# Altium schematic sheet Microcontroller_sch_v22_0.SchDoc
size 326 x 130 mm; Origin: Eagle
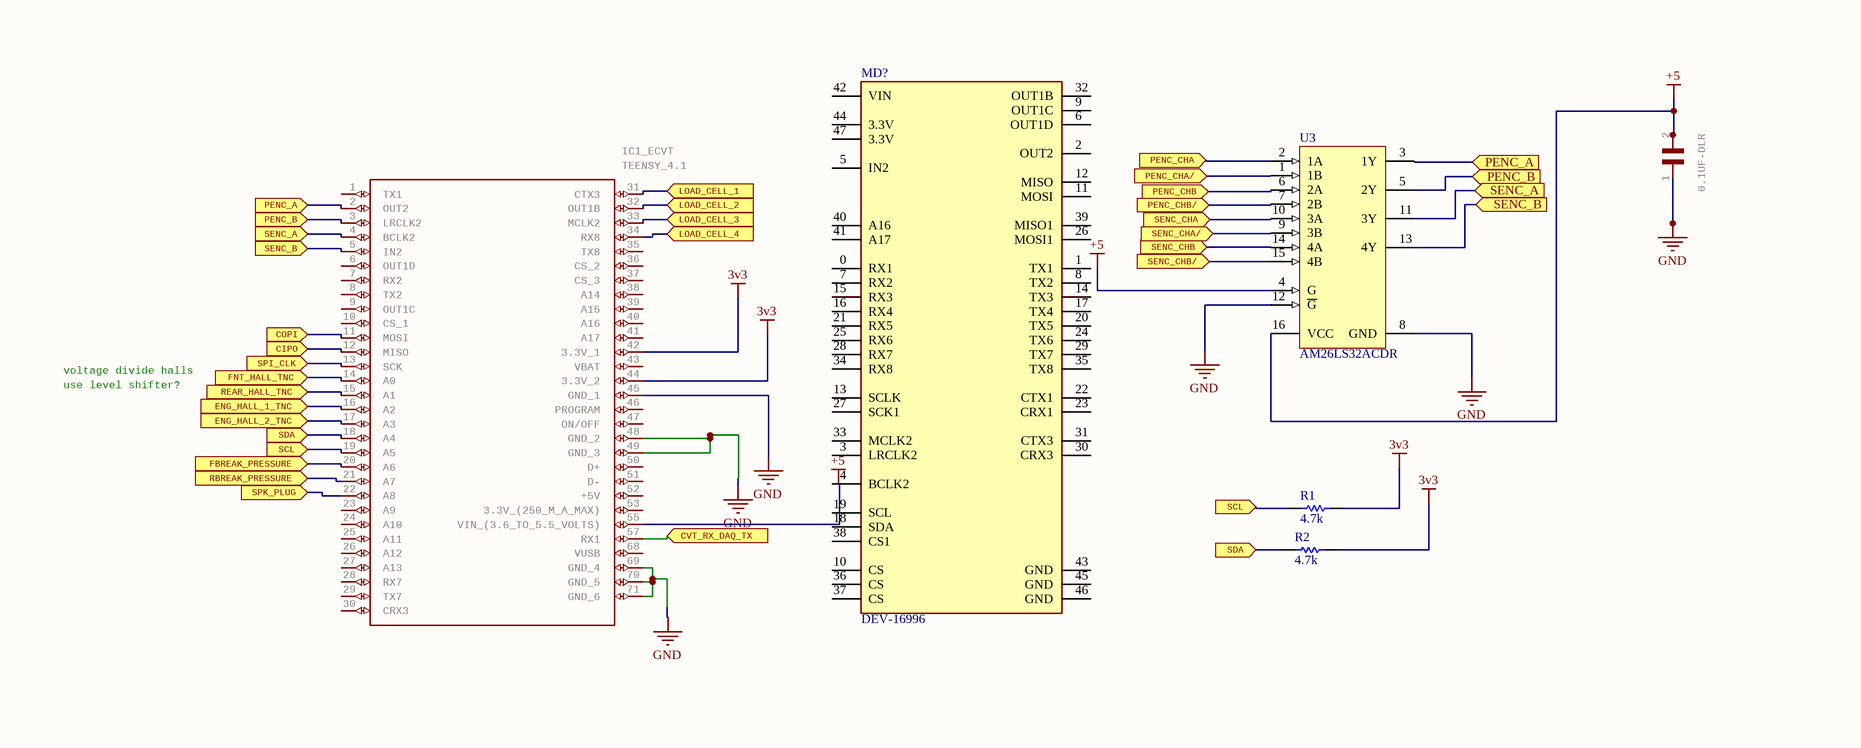
[diagram p0: Microcontroller_sch_v22_0.SchDoc]

## Parts
0.1UF-DLR  08055C104KAT4A  [RESC2012X60N]  (value not drawn)
IC1_ECVT  TEENSY_4.1  [TEENSY41]
MD?  DEV-16996  [FP-DEV-16996-MFG]
R1  4.7k  [RESC2013X50X30LL20T20]
R2  4.7k  [RESC2013X50X30LL20T20]
U3  AM26LS32ACDR  [D0016A_M]

## Ports
CIPO (in, see Microcontroller_sch_v22_1[1B], Microcontroller_sch_v22_1[5C], Microcontroller_sch_v22_4[3C], Microcontroller_sch_v22_4[4C]), COPI (in, see Microcontroller_sch_v22_1[1B], Microcontroller_sch_v22_1[5C], Microcontroller_sch_v22_4[2C], Microcontroller_sch_v22_4[4C]), CVT_RX_DAQ_TX (in, see Microcontroller_sch_v22_1[0A], Microcontroller_sch_v22_2[2C]), ENG_HALL_1_TNC (in, see Microcontroller_sch_v22_1[0C], Microcontroller_sch_v22_3[5B]), ENG_HALL_2_TNC (in, see Microcontroller_sch_v22_1[0C], Microcontroller_sch_v22_3[6B]), FBREAK_PRESSURE (in, see Microcontroller_sch_v22_1[0C], Microcontroller_sch_v22_2[2D]), FNT_HALL_TNC (in, see Microcontroller_sch_v22_1[0B], Microcontroller_sch_v22_3[3B]), LOAD_CELL_1 (in, see Microcontroller_sch_v22_2[4E]), LOAD_CELL_2 (in, see Microcontroller_sch_v22_2[4F]), LOAD_CELL_3 (in, see Microcontroller_sch_v22_2[4F]), LOAD_CELL_4 (in, see Microcontroller_sch_v22_2[4F]), PENC_A (in, see Microcontroller_sch_v22_0[1B]), PENC_A (in, see Microcontroller_sch_v22_0[5A]), PENC_B (in, see Microcontroller_sch_v22_0[1B]), PENC_B (in, see Microcontroller_sch_v22_0[5A]), PENC_CHA (in, see Microcontroller_sch_v22_2[2E]), PENC_CHA/ (in, see Microcontroller_sch_v22_2[2E]), PENC_CHB (in, see Microcontroller_sch_v22_2[2E]), PENC_CHB/ (in, see Microcontroller_sch_v22_2[2F]), RBREAK_PRESSURE (in, see Microcontroller_sch_v22_1[0C], Microcontroller_sch_v22_2[2D]), REAR_HALL_TNC (in, see Microcontroller_sch_v22_1[0B], Microcontroller_sch_v22_3[4B]), SCL (in, see Microcontroller_sch_v22_0[1C], Microcontroller_sch_v22_1[1C], Microcontroller_sch_v22_2[2D]), SCL (in, see Microcontroller_sch_v22_0[4C], Microcontroller_sch_v22_1[1C], Microcontroller_sch_v22_2[2D]), SDA (in, see Microcontroller_sch_v22_0[1C], Microcontroller_sch_v22_1[1C], Microcontroller_sch_v22_2[2C]), SDA (in, see Microcontroller_sch_v22_0[4C], Microcontroller_sch_v22_1[1C], Microcontroller_sch_v22_2[2C]), SENC_A (in, see Microcontroller_sch_v22_0[1B]), SENC_A (in, see Microcontroller_sch_v22_0[5B]), SENC_B (in, see Microcontroller_sch_v22_0[1B]), SENC_B (in, see Microcontroller_sch_v22_0[5B]), SENC_CHA (in, see Microcontroller_sch_v22_2[4B]), SENC_CHA/ (in, see Microcontroller_sch_v22_2[4B]), SENC_CHB (in, see Microcontroller_sch_v22_2[2F]), SENC_CHB/ (in, see Microcontroller_sch_v22_2[2F]), SPI_CLK (in, see Microcontroller_sch_v22_1[0B], Microcontroller_sch_v22_1[4C], Microcontroller_sch_v22_2[4B], Microcontroller_sch_v22_4[2C], Microcontroller_sch_v22_4[4C]), SPK_PLUG (in, see Microcontroller_sch_v22_1[0C], Microcontroller_sch_v22_2[2D])

## Nets
3v3: IC1_ECVT.42(3.3V_1) IC1_ECVT.44(3.3V_2) R1.2 R2.2
+5: 0.1UF-DLR.2 IC1_ECVT.55(VIN_(3.6_TO_5.5_VOLTS)) U3.4(G) U3.16(VCC)
GND: 0.1UF-DLR.1 IC1_ECVT.45(GND_1) IC1_ECVT.48(GND_2) IC1_ECVT.49(GND_3) IC1_ECVT.69(GND_4) IC1_ECVT.70(GND_5) IC1_ECVT.71(GND_6) U3.8(GND) U3.12(~{G})
CIPO: IC1_ECVT.12(MISO) ; port CIPO
COPI: IC1_ECVT.11(MOSI) ; port COPI
CVT_RX_DAQ_TX: IC1_ECVT.57(RX1) ; port CVT_RX_DAQ_TX
ENG_HALL_1_TNC: IC1_ECVT.16(A2) ; port ENG_HALL_1_TNC
ENG_HALL_2_TNC: IC1_ECVT.17(A3) ; port ENG_HALL_2_TNC
FBREAK_PRESSURE: IC1_ECVT.20(A6) ; port FBREAK_PRESSURE
FNT_HALL_TNC: IC1_ECVT.14(A0) ; port FNT_HALL_TNC
LOAD_CELL_1: IC1_ECVT.31(CTX3) ; port LOAD_CELL_1
LOAD_CELL_2: IC1_ECVT.32(OUT1B) ; port LOAD_CELL_2
LOAD_CELL_3: IC1_ECVT.33(MCLK2) ; port LOAD_CELL_3
LOAD_CELL_4: IC1_ECVT.34(RX8) ; port LOAD_CELL_4
PENC_A: IC1_ECVT.2(OUT2) U3.3(1Y) ; port PENC_A
PENC_B: IC1_ECVT.3(LRCLK2) U3.5(2Y) ; port PENC_B
PENC_CHA: U3.2(1A) ; port PENC_CHA
PENC_CHA/: U3.1(1B) ; port PENC_CHA/
PENC_CHB: U3.6(2A) ; port PENC_CHB
PENC_CHB/: U3.7(2B) ; port PENC_CHB/
RBREAK_PRESSURE: IC1_ECVT.21(A7) ; port RBREAK_PRESSURE
REAR_HALL_TNC: IC1_ECVT.15(A1) ; port REAR_HALL_TNC
SCL: IC1_ECVT.19(A5) R1.1 ; port SCL
SDA: IC1_ECVT.18(A4) R2.1 ; port SDA
SENC_A: IC1_ECVT.4(BCLK2) U3.11(3Y) ; port SENC_A
SENC_B: IC1_ECVT.5(IN2) U3.13(4Y) ; port SENC_B
SENC_CHA: U3.10(3A) ; port SENC_CHA
SENC_CHA/: U3.9(3B) ; port SENC_CHA/
SENC_CHB: U3.14(4A) ; port SENC_CHB
SENC_CHB/: U3.15(4B) ; port SENC_CHB/
SPI_CLK: IC1_ECVT.13(SCK) ; port SPI_CLK
SPK_PLUG: IC1_ECVT.22(A8) ; port SPK_PLUG

Not connected (* = marked no-connect by the designer): IC1_ECVT 1(TX1) 6(OUT1D) 7(RX2) 8(TX2) 9(OUT1C) 10(CS_1) 23(A9) 24(A10) 25(A11) 26(A12) 27(A13) 28(RX7) 29(TX7) 30(CRX3) 35(TX8) 36(CS_2) 37(CS_3) 38(A14) 39(A15) 40(A16) 41(A17) 43(VBAT) 46(PROGRAM) 47(ON/OFF) 50(D+) 51(D-) 52(+5V) 53(3.3V_(250_M_A_MAX)) 68(VUSB); MD? 0(RX1) 1(TX1) 2(OUT2) 3(LRCLK2) 4(BCLK2) 5(IN2) 6(OUT1D) 7(RX2) 8(TX2) 9(OUT1C) 10(CS) 11(MOSI) 12(MISO) 13(SCLK) 14(TX3) 15(RX3) 16(RX4) 17(TX4) 18(SDA) 19(SCL) 20(TX5) 21(RX5) 22(CTX1) 23(CRX1) 24(TX6) 25(RX6) 26(MOSI1) 27(SCK1) 28(RX7) 29(TX7) 30(CRX3) 31(CTX3) 32(OUT1B) 33(MCLK2) 34(RX8) 35(TX8) 36(CS) 37(CS) 38(CS1) 39(MISO1) 40(A16) 41(A17) 42(VIN) 43(GND) 44(3.3V) 45(GND) 46(GND) 47(3.3V)

## Notes on the sheet
- voltage divide halls
- use level shifter?

## Library data of the parts
0.1UF-DLR = 08055C104KAT4A: .1UF 50V 10% 0805; GateName_1: G$1; MF: AVX; SymbolName_1: 08055C104KAT4A; LibraryName: 08055C104KAT4A; DeviceSetName: 08055C104KAT4A; DIGI-KEY_PART_NUMBER: 478-10836-1-ND; MP: 08055C104KAT4A; PACKAGE: 2012 AVX; PURCHASE-URL: https://pricing.snapeda.com/search/part/08055C104KAT4A/?ref=eda
IC1_ECVT = TEENSY_4.1: Teensy 4.1 Development Board   Source:  Datasheet; MANUFACTURER_NAME: PJRC; GateName_1: G$1; SymbolName_1: TEENSY_4.1; LibraryName: TEENSY_4.1; DeviceSetName: TEENSY_4.1; ARROW_PART_NUMBER: ARROW_PART_NUMBER; ARROW_PRICE-STOCK: ARROW_PRICE-STOCK; HEIGHT: mm; MANUFACTURER_PART_NUMBER: TEENSY 4.1; MOUSER_PART_NUMBER: MOUSER_PART_NUMBER; MOUSER_PRICE-STOCK: MOUSER_PRICE-STOCK; MOUSER_TESTING_PART_NUMBER: MOUSER_TESTING_PART_NUMBER; MOUSER_TESTING_PRICE-STOCK: MOUSER_TESTING_PRICE-STOCK
MD? = CMP-157412-000001-1: TEENSY 4.1 (HEADERS)
R1 R2 = CMP-2001-04896-1: Manufacturer: Vishay Dale; Part Number: CRCW08050000Z0EA
U3 = CMP-0310-00258-2: Quadruple Differential Line Receiver, 0 TX / 4 RX, 0 to 70 degC, 16-Pin SOIC (D), Green (RoHS & no Sb/Br); Manufacturer: Texas Instruments; Rating: Catalog; ICC(Max)(mA): 70; SubFamily: RS-422; Receivers Per Package: 4; ComponentLink1Description: Datasheet; # of TX/RX: 0 TX / 4 RX; Mounting Technology: Surface Mount; Code_JEDEC: MS-012AC; DatasheetVersion: SLLS115E; ComponentLink2Description: Package Specification; Eco-Plan: Green (RoHS & no Sb/Br); PackageDescription: 16-Pin Plastic Small Outline Integrated Circuit, 9.9 x 3.9 mm, Pitch 1.27 mm Pitch; ComponentLink2URL: http://www.ti.com/litv/pdf/mpds178g; PartNumber: AM26LS32ACDR; PackageReference: D0016A; PackageVersion: revM, Jun-2011; ComponentLink1URL: http://www.ti.com/general/docs/lit/getliterature.tsp?genericPartNumber=AM26LS32AC&fileType=pdf